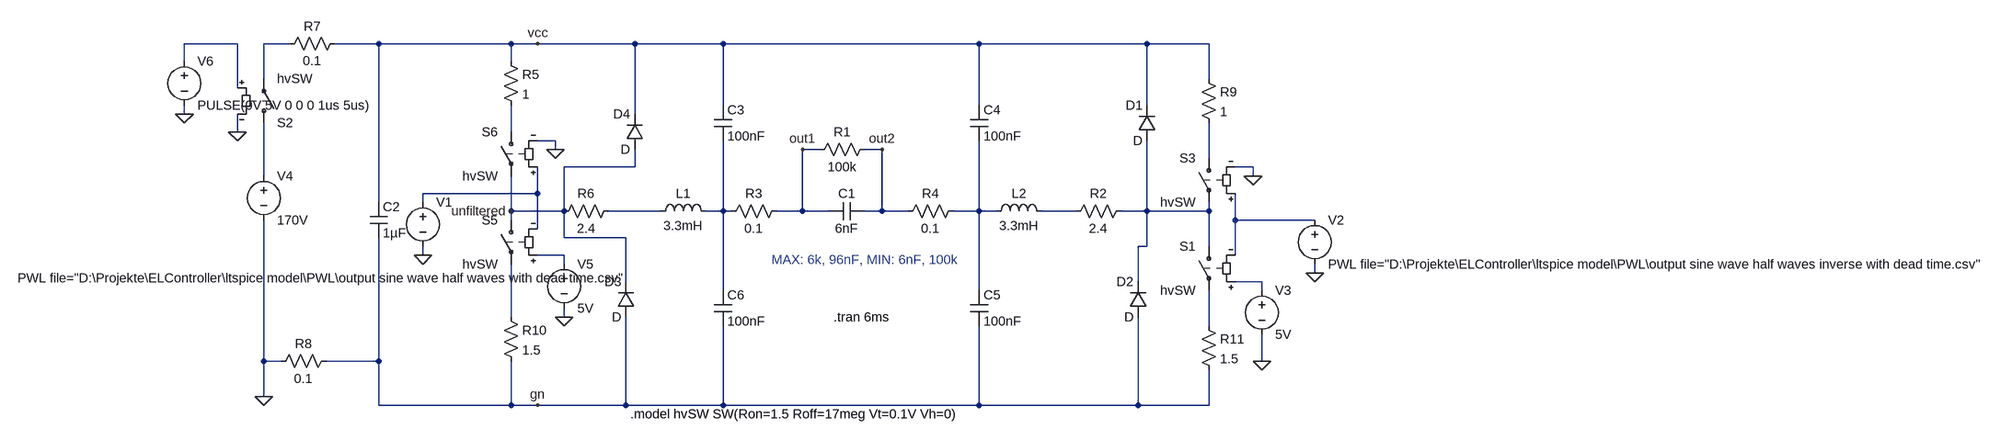
[diagram p0: schematic Filter Test R4b.asc]
Filter Test R4b.asc, the LTspice schematic file:
Version 4
SHEET 1 2672 680
WIRE -848 -224 -944 -224
WIRE -752 -224 -800 -224
WIRE -592 -224 -672 -224
WIRE -352 -224 -592 -224
WIRE -304 -224 -352 -224
WIRE -128 -224 -304 -224
WIRE 32 -224 -128 -224
WIRE 496 -224 32 -224
WIRE 800 -224 496 -224
WIRE 912 -224 800 -224
WIRE -944 -192 -944 -224
WIRE -352 -192 -352 -224
WIRE -800 -160 -800 -224
WIRE 912 -160 912 -224
WIRE -848 -144 -848 -224
WIRE 32 -112 32 -224
WIRE 496 -112 496 -224
WIRE 800 -112 800 -224
WIRE -944 -96 -944 -112
WIRE -128 -96 -128 -224
WIRE -848 -64 -848 -96
WIRE -352 -64 -352 -112
WIRE -272 -48 -304 -48
WIRE -272 -32 -272 -48
WIRE 208 -32 176 -32
WIRE 320 -32 288 -32
WIRE 912 -16 912 -80
WIRE -128 0 -128 -32
WIRE -128 0 -256 0
WIRE 992 0 960 0
WIRE -800 16 -800 -80
WIRE 992 16 992 0
WIRE -304 48 -304 0
WIRE -304 48 -512 48
WIRE -592 64 -592 -224
WIRE -512 64 -512 48
WIRE -352 80 -352 16
WIRE -256 80 -256 0
WIRE -256 80 -352 80
WIRE -80 80 -176 80
WIRE 32 80 32 -48
WIRE 32 80 0 80
WIRE 48 80 32 80
WIRE 176 80 176 -32
WIRE 176 80 128 80
WIRE 224 80 176 80
WIRE 320 80 320 -32
WIRE 320 80 288 80
WIRE 368 80 320 80
WIRE 496 80 496 -48
WIRE 496 80 448 80
WIRE 528 80 496 80
WIRE 672 80 608 80
WIRE 800 80 800 -48
WIRE 800 80 752 80
WIRE 912 80 912 64
WIRE 912 80 800 80
WIRE -352 96 -352 80
WIRE 960 96 960 48
WIRE 1104 96 960 96
WIRE -304 112 -304 48
WIRE -256 128 -256 80
WIRE -144 128 -256 128
WIRE 800 144 800 80
WIRE 800 144 784 144
WIRE 912 144 912 80
WIRE -512 160 -512 144
WIRE -256 160 -304 160
WIRE 960 160 960 96
WIRE -256 176 -256 160
WIRE 1104 192 1104 176
WIRE -144 208 -144 128
WIRE 784 208 784 144
WIRE 1008 208 960 208
WIRE 32 224 32 80
WIRE 496 224 496 80
WIRE 1008 224 1008 208
WIRE -352 272 -352 176
WIRE -256 272 -256 256
WIRE 912 288 912 224
WIRE -800 352 -800 96
WIRE -768 352 -800 352
WIRE -592 352 -592 128
WIRE -592 352 -688 352
WIRE 1008 352 1008 304
WIRE -800 416 -800 352
WIRE -592 432 -592 352
WIRE -352 432 -352 352
WIRE -352 432 -592 432
WIRE -304 432 -352 432
WIRE -144 432 -144 272
WIRE -144 432 -304 432
WIRE 32 432 32 288
WIRE 32 432 -144 432
WIRE 496 432 496 288
WIRE 496 432 32 432
WIRE 784 432 784 272
WIRE 784 432 496 432
WIRE 912 432 912 368
WIRE 912 432 784 432
FLAG 176 -32 out1
FLAG 320 -32 out2
FLAG 1008 352 0
FLAG 992 16 0
FLAG 1104 192 0
FLAG -800 416 0
FLAG -256 272 0
FLAG -272 -32 0
FLAG -512 160 0
FLAG -304 -224 vcc
FLAG -304 432 gn
FLAG -352 80 unfiltered
FLAG -848 -64 0
FLAG -944 -96 0
SYMBOL voltage -512 48 R0
WINDOW 123 0 0 Left 0
WINDOW 39 0 0 Left 0
WINDOW 3 -734 153 Left 2
SYMATTR Value PWL file="D:\Projekte\ELController\ltspice model\PWL\output sine wave half waves with dead time.csv"
SYMATTR InstName V1
SYMBOL cap 288 64 R90
WINDOW 0 0 32 VBottom 2
WINDOW 3 32 32 VTop 2
SYMATTR InstName C1
SYMATTR Value 6nF
SYMBOL voltage 1104 80 R0
WINDOW 123 0 0 Left 0
WINDOW 39 0 0 Left 0
SYMATTR InstName V2
SYMATTR Value PWL file="D:\Projekte\ELController\ltspice model\PWL\output sine wave half waves inverse with dead time.csv"
SYMBOL ind -96 96 R270
WINDOW 0 32 56 VTop 2
WINDOW 3 5 56 VBottom 2
SYMATTR InstName L1
SYMATTR Value 3.3mH
SYMATTR SpiceLine Ipk=1
SYMBOL ind 512 96 R270
WINDOW 0 32 56 VTop 2
WINDOW 3 5 56 VBottom 2
SYMATTR InstName L2
SYMATTR Value 3.3mH
SYMATTR SpiceLine Ipk=1
SYMBOL res 304 -48 R90
WINDOW 0 0 56 VBottom 2
WINDOW 3 32 56 VTop 2
SYMATTR InstName R1
SYMATTR Value 100k
SYMBOL sw 912 128 M0
SYMATTR InstName S1
SYMATTR Value hvSW
SYMBOL sw 912 -32 M0
SYMATTR InstName S3
SYMATTR Value hvSW
SYMBOL voltage 1008 208 R0
WINDOW 123 0 0 Left 0
WINDOW 39 0 0 Left 0
SYMATTR InstName V3
SYMATTR Value 5V
SYMBOL sw -352 80 M0
SYMATTR InstName S5
SYMATTR Value hvSW
SYMBOL sw -352 -80 M0
SYMATTR InstName S6
SYMATTR Value hvSW
SYMBOL voltage -256 160 R0
WINDOW 123 0 0 Left 0
WINDOW 39 0 0 Left 0
SYMATTR InstName V5
SYMATTR Value 5V
SYMBOL res -160 64 R90
WINDOW 0 0 56 VBottom 2
WINDOW 3 32 56 VTop 2
SYMATTR InstName R6
SYMATTR Value 2.4
SYMBOL cap -608 64 R0
SYMATTR InstName C2
SYMATTR Value 1µF
SYMBOL res -656 -240 R90
WINDOW 0 0 56 VBottom 2
WINDOW 3 32 56 VTop 2
SYMATTR InstName R7
SYMATTR Value 0.1
SYMBOL res -672 336 R90
WINDOW 0 0 56 VBottom 2
WINDOW 3 32 56 VTop 2
SYMATTR InstName R8
SYMATTR Value 0.1
SYMBOL res 768 64 R90
WINDOW 0 0 56 VBottom 2
WINDOW 3 32 56 VTop 2
SYMATTR InstName R2
SYMATTR Value 2.4
SYMBOL voltage -800 0 R0
WINDOW 123 0 0 Left 0
WINDOW 39 0 0 Left 0
SYMATTR InstName V4
SYMATTR Value 170V
SYMBOL res 144 64 R90
WINDOW 0 0 56 VBottom 2
WINDOW 3 32 56 VTop 2
SYMATTR InstName R3
SYMATTR Value 0.1
SYMBOL res 464 64 R90
WINDOW 0 0 56 VBottom 2
WINDOW 3 32 56 VTop 2
SYMATTR InstName R4
SYMATTR Value 0.1
SYMBOL res -368 -208 R0
SYMATTR InstName R5
SYMATTR Value 1
SYMBOL res 896 -176 R0
SYMATTR InstName R9
SYMATTR Value 1
SYMBOL res -368 256 R0
SYMATTR InstName R10
SYMATTR Value 1.5
SYMBOL res 896 272 R0
SYMATTR InstName R11
SYMATTR Value 1.5
SYMBOL diode 816 -48 R180
WINDOW 0 24 64 Left 2
WINDOW 3 24 0 Left 2
SYMATTR InstName D1
SYMBOL diode 800 272 R180
WINDOW 0 24 64 Left 2
WINDOW 3 24 0 Left 2
SYMATTR InstName D2
SYMBOL diode -128 272 R180
WINDOW 0 24 64 Left 2
WINDOW 3 24 0 Left 2
SYMATTR InstName D3
SYMBOL diode -112 -32 R180
WINDOW 0 24 64 Left 2
WINDOW 3 24 0 Left 2
SYMATTR InstName D4
SYMBOL sw -800 -64 M180
SYMATTR InstName S2
SYMATTR Value hvSW
SYMBOL voltage -944 -208 R0
WINDOW 123 0 0 Left 0
WINDOW 39 0 0 Left 0
SYMATTR InstName V6
SYMATTR Value PULSE(0V 5V 0 0 0 1us 5us)
SYMBOL cap 16 -112 R0
SYMATTR InstName C3
SYMATTR Value 100nF
SYMBOL cap 480 -112 R0
SYMATTR InstName C4
SYMATTR Value 100nF
SYMBOL cap 480 224 R0
SYMATTR InstName C5
SYMATTR Value 100nF
SYMBOL cap 16 224 R0
SYMATTR InstName C6
SYMATTR Value 100nF
TEXT 232 272 Left 2 !.tran 6ms
TEXT -136 448 Left 2 !.model hvSW SW(Ron=1.5 Roff=17meg Vt=0.1V Vh=0)
TEXT 120 168 Left 2 ;MAX: 6k, 96nF, MIN: 6nF, 100k

The netlist it stands for:
* Filter Test R4b.asc
V1 N006 0 PWL file="D:\Projekte\ELController\ltspice model\PWL\output sine wave half waves with dead time.csv"
C1 out2 out1 6nF
V2 N012 0 PWL file="D:\Projekte\ELController\ltspice model\PWL\output sine wave half waves inverse with dead time.csv"
L1 N007 N008 3.3mH Ipk=1
L2 N009 N010 3.3mH Ipk=1
R1 out2 out1 100k
S1 N011 N016 N014 N012 hvSW
S3 N004 N011 N012 0 hvSW
V3 N014 0 5V
S5 unfiltered N015 N013 N006 hvSW
S6 N003 unfiltered N006 0 hvSW
V5 N013 0 5V
R6 N007 unfiltered 2.4
C2 vcc gn 1µF
R7 vcc N002 0.1
R8 gn 0 0.1
R2 N011 N010 2.4
V4 N005 0 170V
R3 out1 N008 0.1
R4 N009 out2 0.1
R5 vcc N003 1
R9 vcc N004 1
R10 N015 gn 1.5
R11 N016 gn 1.5
D1 N011 vcc D
D2 gn N011 D
D3 gn unfiltered D
D4 unfiltered vcc D
S2 N005 N002 N001 0 hvSW
V6 N001 0 PULSE(0V 5V 0 0 0 1us 5us)
C3 vcc N008 100nF
C4 vcc N009 100nF
C5 N009 gn 100nF
C6 N008 gn 100nF
.model D D
.lib standard.dio
.tran 6ms
.model hvSW SW(Ron=1.5 Roff=17meg Vt=0.1V Vh=0)
* MAX: 6k, 96nF, MIN: 6nF, 100k
.backanno
.end